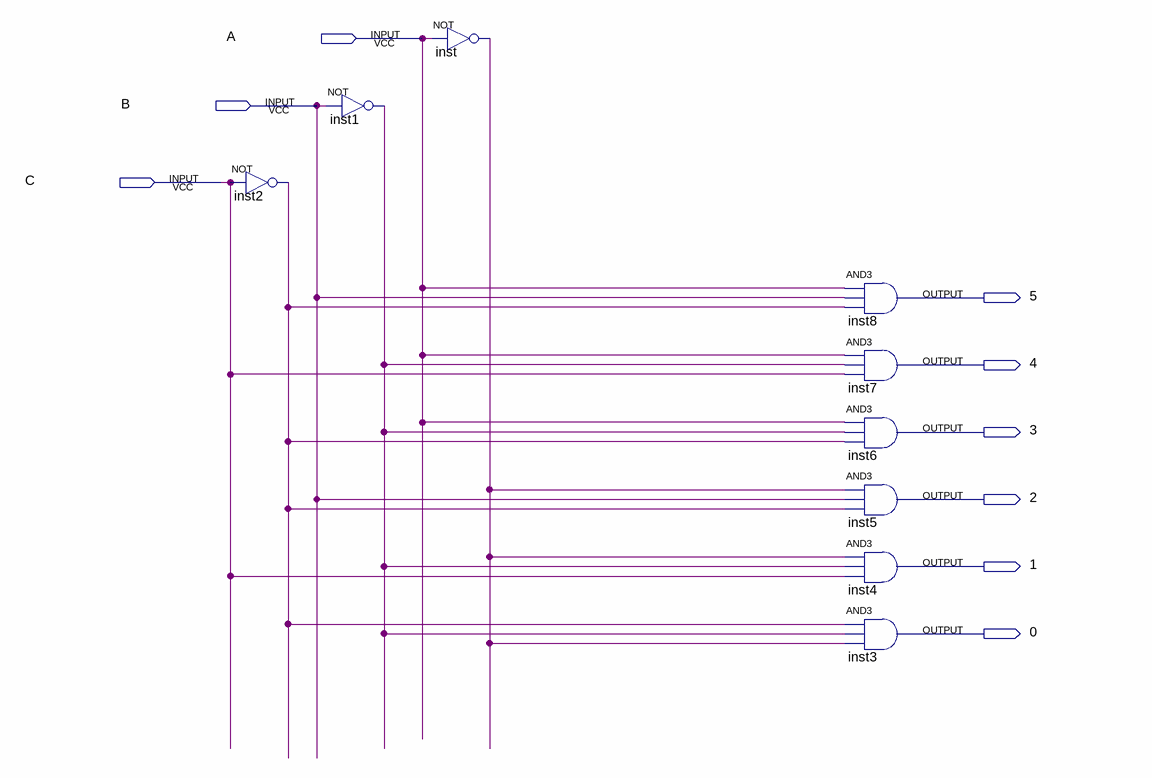
[diagram p0: schematic sheet]
// Quartus schematic DEMUX6.bdf as structural Verilog: 9 symbols, 9 pins
module DEMUX6 (
  input  A,
  input  B,
  input  C,
  output \5 ,
  output \4 ,
  output \3 ,
  output \2 ,
  output \1 ,
  output \0 
);

  wire inst1_out, inst2_out, inst_out;

  not inst2 (inst2_out, C);
  not inst1 (inst1_out, B);
  not inst (inst_out, A);
  and inst8 (\5 , A, B, inst2_out);
  and inst7 (\4 , A, inst1_out, C);
  and inst6 (\3 , A, inst1_out, inst2_out);
  and inst5 (\2 , inst_out, B, inst2_out);
  and inst4 (\1 , inst_out, inst1_out, C);
  and inst3 (\0 , inst2_out, inst1_out, inst_out);
endmodule
